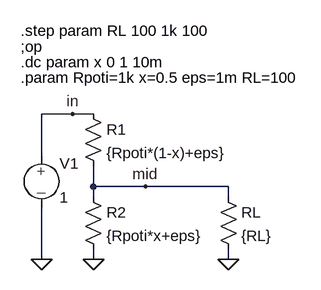
[diagram p0: schematic Spannungsteiler.asc]
Spannungsteiler.asc, the LTspice schematic file:
Version 4
SHEET 1 880 680
WIRE 128 96 80 96
WIRE 160 96 128 96
WIRE 80 160 80 96
WIRE 160 208 160 176
WIRE 240 208 160 208
WIRE 368 208 240 208
WIRE 160 224 160 208
WIRE 368 224 368 208
WIRE 80 320 80 240
WIRE 160 320 160 304
WIRE 368 320 368 304
FLAG 80 320 0
FLAG 160 320 0
FLAG 240 208 mid
FLAG 128 96 in
FLAG 368 320 0
SYMBOL res 144 80 R0
SYMATTR InstName R1
SYMATTR Value {Rpoti*(1-x)+eps}
SYMBOL res 144 208 R0
SYMATTR InstName R2
SYMATTR Value {Rpoti*x+eps}
SYMBOL source-V 80 144 R0
SYMATTR InstName V1
SYMATTR Value 1
SYMBOL res 352 208 R0
SYMATTR InstName RL
SYMATTR Value {RL}
TEXT 48 40 Left 2 !.param Rpoti=1k x=0.5 eps=1m RL=100
TEXT 48 -8 Left 2 !;op
TEXT 48 16 Left 2 !.dc param x 0 1 10m
TEXT 48 -32 Left 2 !.step param RL 100 1k 100

The netlist it stands for:
* Spannungsteiler.asc
R1 in mid {Rpoti*(1-x)+eps}
R2 mid 0 {Rpoti*x+eps}
V1 in 0 1
RL mid 0 {RL}
.param Rpoti=1k x=0.5 eps=1m RL=100
;op
.dc param x 0 1 10m
.step param RL 100 1k 100
.backanno
.end